# EAGLE schematic ESPixel (EAGLE 7.4.0)
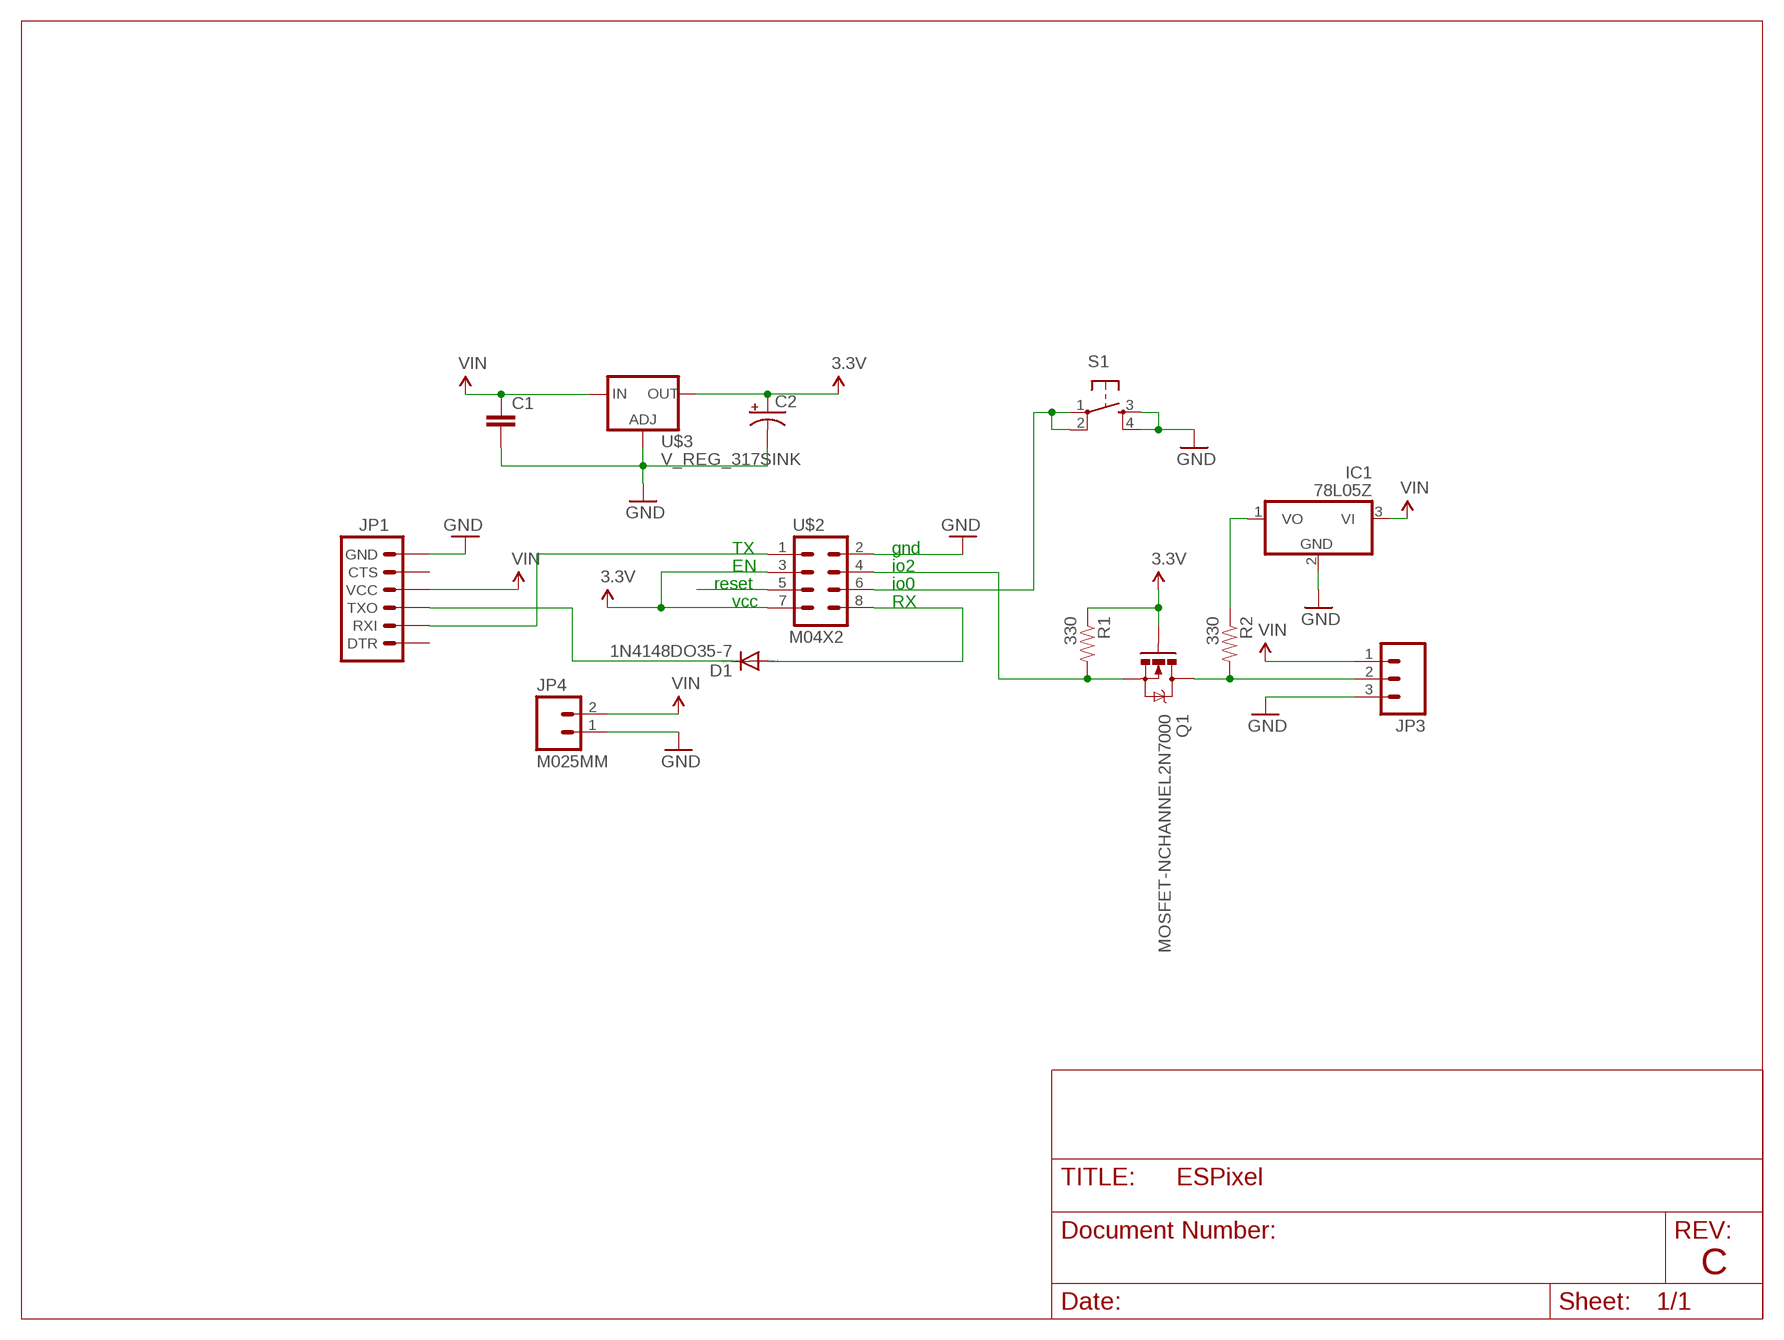
[diagram p0: schematic, sheet 1]

## Parts
C1  CAPEZ  [CAP-PTH-SMALLEZ]
C2  CAP_POLPTH2  [CPOL-RADIAL-10UF-25V]
D1  1N4148DO35-7  [DO35-7]
IC1  78L05Z  [TO92]
JP1  ARDUINO_SERIAL_PROGRAMLOCK  [1X06_LOCK]
JP3  M03-SCREW-5MM  [SCREWTERMINAL-5MM-3]
JP4  M025MM  [SCREWTERMINAL-5MM-2]
Q1  MOSFET-NCHANNEL2N7000  [TO-92]
R1  330  RESISTOREZ  [AXIAL-0.3EZ]
R2  330  RESISTOREZ  [AXIAL-0.3EZ]
S1  TAC_SWITCHPTH  [TACTILE-PTH]
U$2  M04X2  [2X4]
U$3  V_REG_317SINK  [TO220-ADJ]

## Nets
3.3V [PWR]: C2.1(+) Q1.2(G) R1.P$1 U$2.3 U$2.7 U$3.OUT
GND: C1.2 C2.2(-) IC1.2(GND) JP1.6(GND) JP3.3 JP4.1 S1.3 S1.4 U$2.2 U$3.ADJ
N$1: JP1.2(RXI) U$2.1
N$2 [PWR]: IC1.1(VO) R2.P$1
N$3: U$2.5
N$4: JP3.2 Q1.3(D) R2.P$2
N$6: Q1.1(S) R1.P$2 U$2.4
N$7: S1.1 S1.2 U$2.6
N$8: D1.C JP1.3(TXO)
N$9: D1.A U$2.8
VIN [PWR]: C1.1 IC1.3(VI) JP1.4(VCC) JP3.1 JP4.2 U$3.IN
Unconnected: JP1.1(DTR) JP1.5(CTS)

## Notes on the sheet
- TX | gnd
- EN | io2
- reset | io0
- vcc | RX
- C

## Library data of the parts
C1 = SparkFun-Capacitors:CAP: Capacitor Standard 0603 ceramic capacitor, and 0.1" leaded capacitor.
C2 = SparkFun-Capacitors:CAP_POL: Capacitor Polarized These are standard SMD and PTH capacitors. Normally 10uF, 47uF, and 100uF in electrolytic and tantalum varieties. Always verify the external diameter of the through hole cap, it varies with capacity, voltage, and manufacturer. The EIA devices should be standard.
D1 = diode:1N4148: DIODE high speed (Philips)
IC1 = linear:78*: Positive VOLTAGE REGULATOR Source: http://cache.national.com/ds/LM/LM78L05.pdf http://www.fairchildsemi.com/ds/LM/LM7805.pdf
JP1 = SparkFun-Connectors:ARDUINO_SERIAL_PROGRAM: FTDI connector footprints
JP3 = SparkFun-Connectors:M03: Header 3 Standard 3-pin 0.1" header. Use with straight break away headers (SKU : PRT-00116), right angle break away headers (PRT-00553), swiss pins (PRT-00743), machine pins (PRT-00117), and female headers (PRT-00115). Molex polarized connector foot print use with SKU : PRT-08232 with associated crimp pins and housings.; STOREFRONT_ID: PRT-08433
JP4 = SparkFun-Connectors:M02: Standard 2-pin 0.1" header. Use with - straight break away headers ( PRT-00116) - right angle break away headers (PRT-00553) - swiss pins (PRT-00743) - machine pins (PRT-00117) - female headers (PRT-00115) Molex polarized connector foot print use with: PRT-08233 with associated crimp pins and housings. 2.54_SCREWTERM for use with PRT-10571. 3.5mm Screw Terminal footprints for PRT-08084 5mm Screw Terminal footprints for use with PRT-08432; STOREFRONT_ID: PRT-08432
Q1 = SparkFun-DiscreteSemi:MOSFET-NCHANNEL: Common NMOSFET Parts MFG P/N Store ID Prod ID FDD8780 TRANS-09984 SI7820DN TRANS-11055 FDS6630A IC-08089 2N7002PW TRANS-11151 FQP30N06L COM-10213 TRANS-10060 BSS123LT1G TRANS-08345 BSS138 TRANS-00830 BS170 2N7000
R1 R2 = SparkFun-Resistors:RESISTOR: Resistor Basic schematic elements and footprints for 0603, 1206, and PTH resistors.
S1 = SparkFun-Retired:TAC_SWITCH: Momentary Switch Button commonly used for reset or general input. Spark Fun Electronics SKU : COM-00097 SMT- SWCH-08247
U$2 = SparkFun-Connectors:M04X2: .1" header, two rows of four.
U$3 = SparkFun-PowerIC:V_REG_317: Voltage Regulator Standard LM317 adjustable voltage regulator. AOI (Adjust Output Input). Google 'LM317 Calculator' for easy to use app to get the two resistor values needed. 240/720 for 5V output. 240/390 for 3.3V output. Spark Fun Electronics SKU : COM-00527

## Net classes
0 default: width 0.305 mm
1 PWR: width 0.508 mm